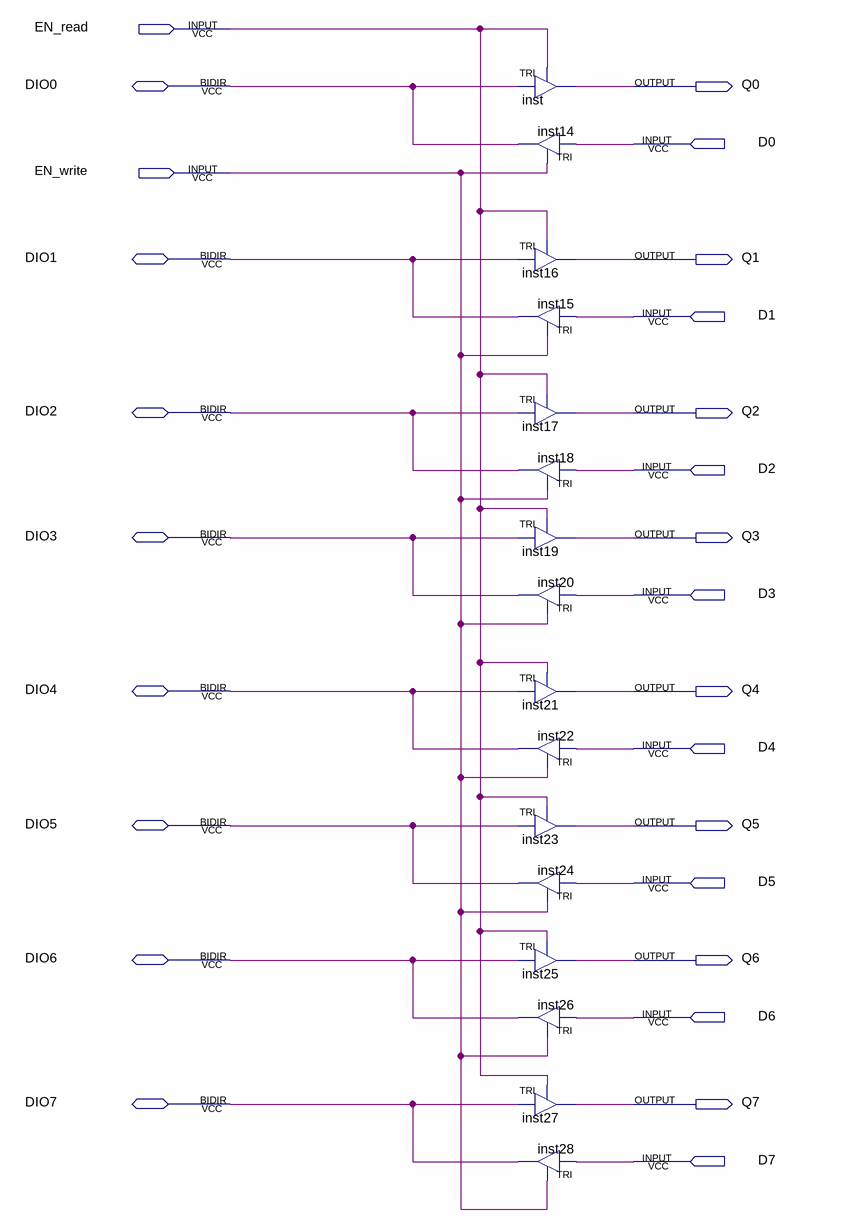
[diagram p0: schematic sheet]
// Quartus schematic 3_state_2_gate.bdf as structural Verilog: 16 symbols, 26 pins
module \3_state_2_gate  (
  input  EN_read,
  input  D0,
  input  EN_write,
  input  D1,
  input  D2,
  input  D3,
  input  D4,
  input  D5,
  input  D6,
  input  D7,
  inout  DIO0,
  inout  DIO1,
  inout  DIO2,
  inout  DIO3,
  inout  DIO4,
  inout  DIO5,
  inout  DIO6,
  inout  DIO7,
  output Q0,
  output Q1,
  output Q2,
  output Q3,
  output Q4,
  output Q5,
  output Q6,
  output Q7
);

  TRI inst (.IN(DIO0), .OE(EN_read), .OUT(Q0));
  TRI inst14 (.IN(D0), .OE(EN_write), .OUT(DIO0));
  TRI inst16 (.IN(DIO1), .OE(EN_read), .OUT(Q1));
  TRI inst15 (.IN(D1), .OE(EN_write), .OUT(DIO1));
  TRI inst17 (.IN(DIO2), .OE(EN_read), .OUT(Q2));
  TRI inst18 (.IN(D2), .OE(EN_write), .OUT(DIO2));
  TRI inst19 (.IN(DIO3), .OE(EN_read), .OUT(Q3));
  TRI inst20 (.IN(D3), .OE(EN_write), .OUT(DIO3));
  TRI inst21 (.IN(DIO4), .OE(EN_read), .OUT(Q4));
  TRI inst22 (.IN(D4), .OE(EN_write), .OUT(DIO4));
  TRI inst23 (.IN(DIO5), .OE(EN_read), .OUT(Q5));
  TRI inst24 (.IN(D5), .OE(EN_write), .OUT(DIO5));
  TRI inst25 (.IN(DIO6), .OE(EN_read), .OUT(Q6));
  TRI inst26 (.IN(D6), .OE(EN_write), .OUT(DIO6));
  TRI inst27 (.IN(DIO7), .OE(EN_read), .OUT(Q7));
  TRI inst28 (.IN(D7), .OE(EN_write), .OUT(DIO7));
endmodule
